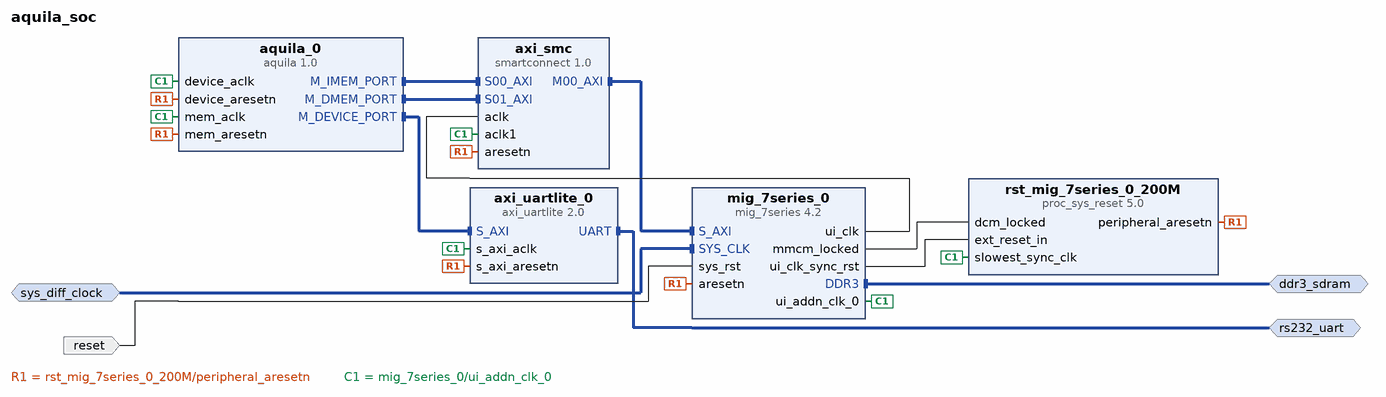
[diagram p0: block diagram of the top level]
# Vivado block design aquila_soc, xc7k325tffg900-2, Vivado 2018.2
create_bd_design aquila_soc

create_bd_intf_port -mode Master -vlnv xilinx.com:interface:ddrx_rtl:1.0 ddr3_sdram
create_bd_intf_port -mode Slave -vlnv xilinx.com:interface:diff_clock_rtl:1.0 sys_diff_clock
set_property -dict {CONFIG.FREQ_HZ 100000000} [get_bd_intf_ports sys_diff_clock]
create_bd_intf_port -mode Master -vlnv xilinx.com:interface:uart_rtl:1.0 rs232_uart
create_bd_port -dir I -type rst reset
set_property -dict {CONFIG.POLARITY ACTIVE_HIGH} [get_bd_ports reset]

create_bd_cell -type ip -vlnv xilinx.com:ip:mig_7series:4.2 mig_7series_0
set_property -dict {CONFIG.RESET_BOARD_INTERFACE reset CONFIG.BOARD_MIG_PARAM ddr3_sdram} [get_bd_cells mig_7series_0]
create_bd_cell -type ip -vlnv xilinx.com:ip:axi_uartlite:2.0 axi_uartlite_0
set_property -dict [list \
  CONFIG.C_BAUDRATE 115200 \
  CONFIG.USE_BOARD_FLOW true \
  CONFIG.UARTLITE_BOARD_INTERFACE rs232_uart \
] [get_bd_cells axi_uartlite_0]
create_bd_cell -type ip -vlnv xilinx.com:ip:smartconnect:1.0 axi_smc
set_property -dict {CONFIG.NUM_SI 2 CONFIG.NUM_CLKS 2} [get_bd_cells axi_smc]
create_bd_cell -type ip -vlnv xilinx.com:ip:proc_sys_reset:5.0 rst_mig_7series_0_200M
create_bd_cell -type ip -vlnv xilinx.com:user:aquila:1.0 aquila_0
set_property -dict [list \
  CONFIG.C_M_DMEM_PORT_WUSER_WIDTH 0 \
  CONFIG.C_M_DMEM_PORT_RUSER_WIDTH 0 \
  CONFIG.C_M_IMEM_PORT_AWUSER_WIDTH 1 \
  CONFIG.C_M_IMEM_PORT_ARUSER_WIDTH 1 \
  CONFIG.C_M_IMEM_PORT_WUSER_WIDTH 0 \
  CONFIG.C_M_IMEM_PORT_RUSER_WIDTH 0 \
  CONFIG.C_M_IMEM_PORT_BUSER_WIDTH 1 \
] [get_bd_cells aquila_0]

# ---- connections ----

connect_bd_intf_net -intf_net smartconnect_0_M00_AXI [get_bd_intf_pins axi_smc/M00_AXI] [get_bd_intf_pins mig_7series_0/S_AXI]
connect_bd_intf_net [get_bd_intf_pins aquila_0/M_DEVICE_PORT] [get_bd_intf_pins axi_uartlite_0/S_AXI]
connect_bd_intf_net -intf_net aquila_0_M_ICACHE_PORT [get_bd_intf_pins aquila_0/M_IMEM_PORT] [get_bd_intf_pins axi_smc/S00_AXI]
connect_bd_intf_net -intf_net aquila_0_M_DCACHE_PORT [get_bd_intf_pins aquila_0/M_DMEM_PORT] [get_bd_intf_pins axi_smc/S01_AXI]
connect_bd_intf_net [get_bd_intf_ports ddr3_sdram] [get_bd_intf_pins mig_7series_0/DDR3]
connect_bd_intf_net [get_bd_intf_ports sys_diff_clock] [get_bd_intf_pins mig_7series_0/SYS_CLK]
connect_bd_intf_net [get_bd_intf_ports rs232_uart] [get_bd_intf_pins axi_uartlite_0/UART]
connect_bd_net [get_bd_ports reset] [get_bd_pins mig_7series_0/sys_rst]
connect_bd_net [get_bd_pins mig_7series_0/mmcm_locked] [get_bd_pins rst_mig_7series_0_200M/dcm_locked]
connect_bd_net [get_bd_pins mig_7series_0/ui_clk_sync_rst] [get_bd_pins rst_mig_7series_0_200M/ext_reset_in]
connect_bd_net [get_bd_pins rst_mig_7series_0_200M/peripheral_aresetn] \
  [get_bd_pins axi_uartlite_0/s_axi_aresetn] [get_bd_pins axi_smc/aresetn] [get_bd_pins mig_7series_0/aresetn] \
  [get_bd_pins aquila_0/device_aresetn] [get_bd_pins aquila_0/mem_aresetn]
connect_bd_net [get_bd_pins mig_7series_0/ui_clk] [get_bd_pins axi_smc/aclk]
connect_bd_net [get_bd_pins mig_7series_0/ui_addn_clk_0] \
  [get_bd_pins rst_mig_7series_0_200M/slowest_sync_clk] [get_bd_pins axi_smc/aclk1] [get_bd_pins axi_uartlite_0/s_axi_aclk] \
  [get_bd_pins aquila_0/device_aclk] [get_bd_pins aquila_0/mem_aclk]

# ---- address map ----
assign_bd_address -offset 0xC0000000 -range 64K -target_address_space [get_bd_addr_spaces aquila_0/M_DEVICE_PORT] [get_bd_addr_segs axi_uartlite_0/S_AXI/Reg]
assign_bd_address -offset 0x80000000 -range 1G -target_address_space [get_bd_addr_spaces aquila_0/M_DMEM_PORT] [get_bd_addr_segs mig_7series_0/memmap/memaddr]
assign_bd_address -offset 0x80000000 -range 1G -target_address_space [get_bd_addr_spaces aquila_0/M_IMEM_PORT] [get_bd_addr_segs mig_7series_0/memmap/memaddr]

validate_bd_design
save_bd_design
